# EAGLE design mega_connector_shield (EAGLE 7.3.0)
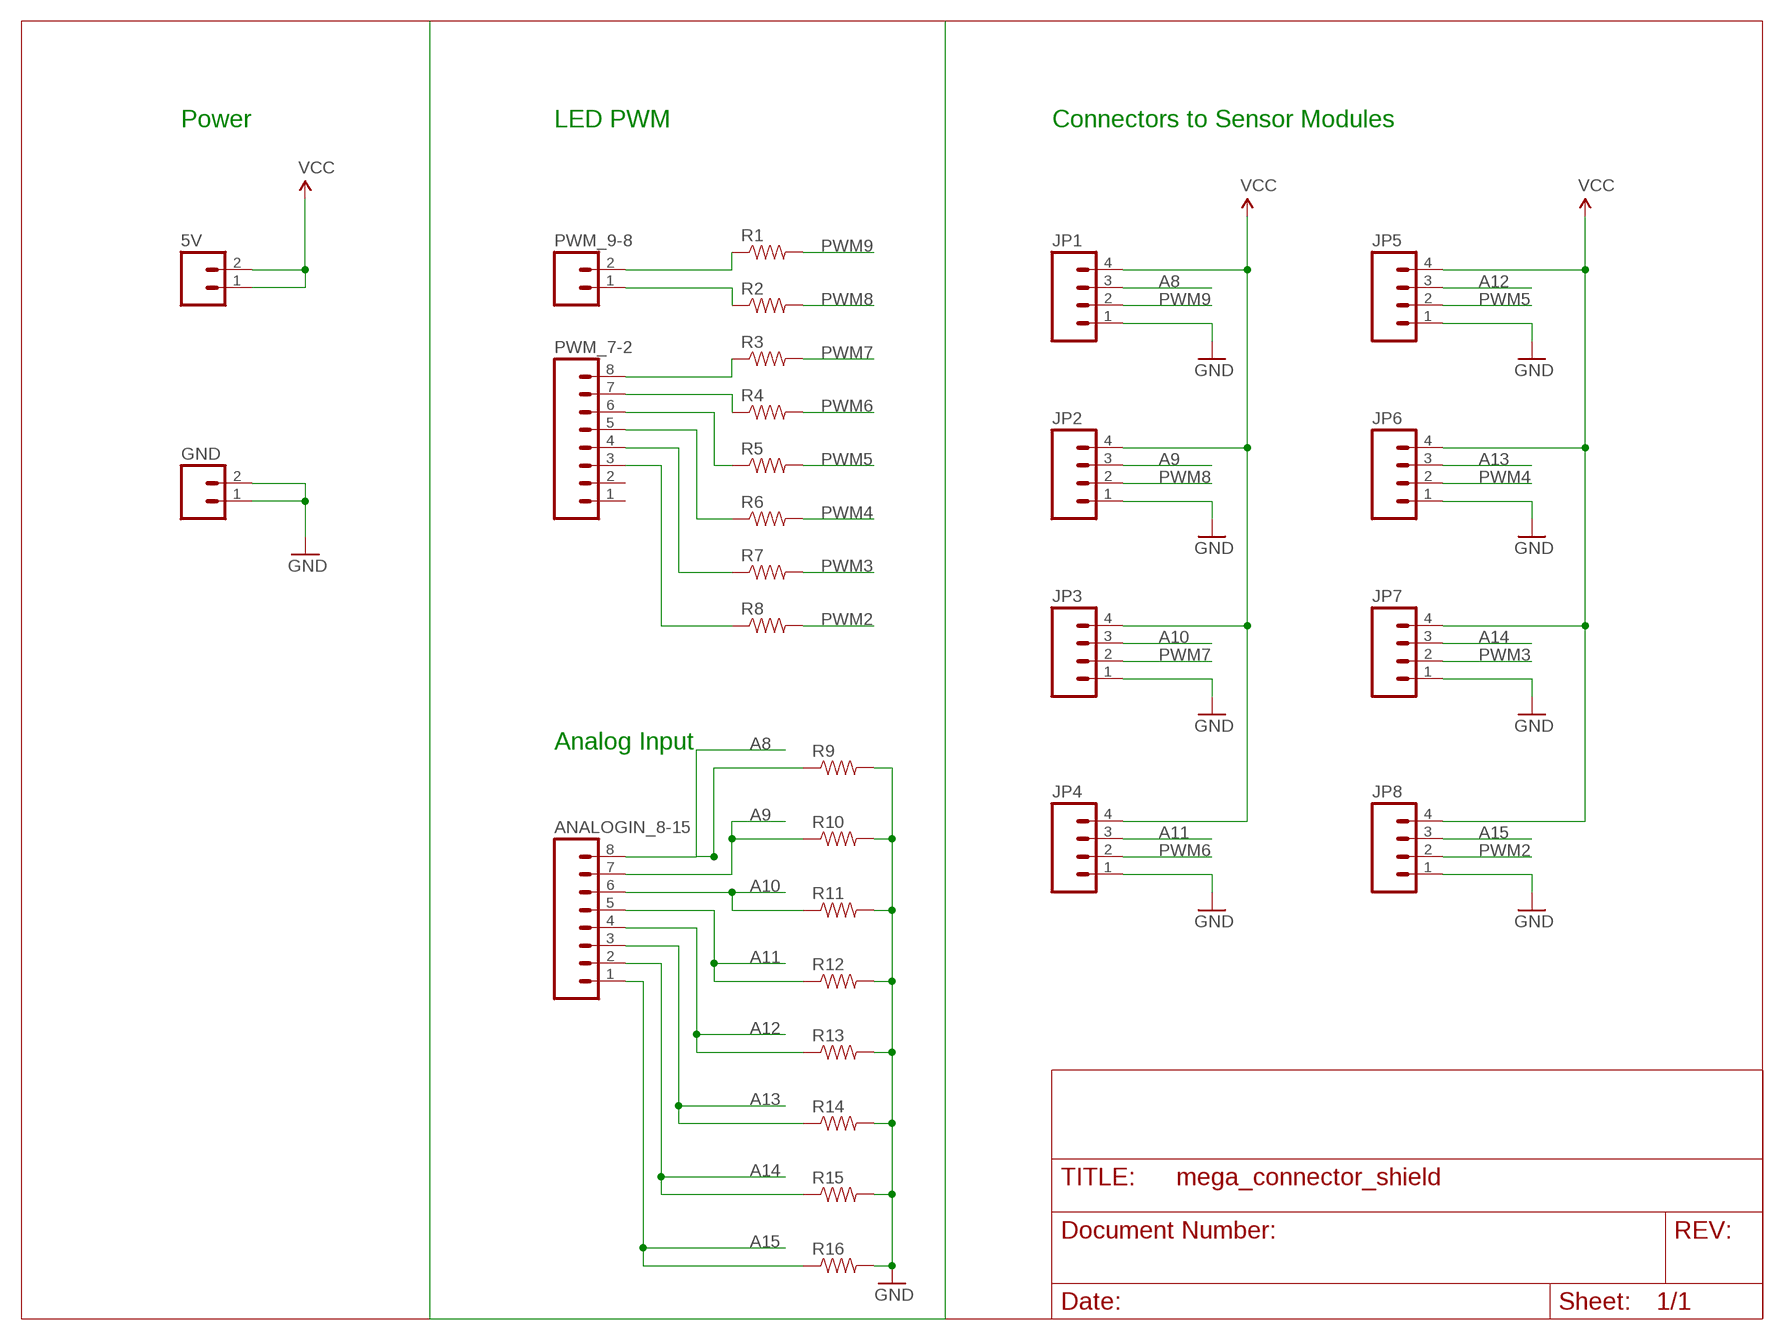
[diagram p0: schematic, sheet 1]

## Parts
5V  M02PTH  [1X02]
ANALOGIN_8-15  M08  [1X08_ROUND]
GND  M02PTH  [1X02]
JP1  M04POLAR  [MOLEX-1X4]
JP2  M04POLAR  [MOLEX-1X4]
JP3  M04POLAR  [MOLEX-1X4]
JP4  M04POLAR  [MOLEX-1X4]
JP5  M04POLAR  [MOLEX-1X4]
JP6  M04POLAR  [MOLEX-1X4]
JP7  M04POLAR  [MOLEX-1X4]
JP8  M04POLAR  [MOLEX-1X4]
PWM_7-2  M08  [1X08_ROUND]
PWM_9-8  M02PTH  [1X02]
R1  RESISTOR1206  [1206]
R2  RESISTOR1206  [1206]
R3  RESISTOR1206  [1206]
R4  RESISTOR1206  [1206]
R5  RESISTOR1206  [1206]
R6  RESISTOR1206  [1206]
R7  RESISTOR1206  [1206]
R8  RESISTOR1206  [1206]
R9  RESISTOR1206  [1206]
R10  RESISTOR1206  [1206]
R11  RESISTOR1206  [1206]
R12  RESISTOR1206  [1206]
R13  RESISTOR1206  [1206]
R14  RESISTOR1206  [1206]
R15  RESISTOR1206  [1206]
R16  RESISTOR1206  [1206]

## Nets
A8: ANALOGIN_8-15.8 JP1.3 R9.1
A9: ANALOGIN_8-15.7 JP2.3 R10.1
A10: ANALOGIN_8-15.6 JP3.3 R11.1
A11: ANALOGIN_8-15.5 JP4.3 R12.1
A12: ANALOGIN_8-15.4 JP5.3 R13.1
A13: ANALOGIN_8-15.3 JP6.3 R14.1
A14: ANALOGIN_8-15.2 JP7.3 R15.1
A15: ANALOGIN_8-15.1 JP8.3 R16.1
GND: GND.1 GND.2 JP1.1 JP2.1 JP3.1 JP4.1 JP5.1 JP6.1 JP7.1 JP8.1 R9.2 R10.2 R11.2 R12.2 R13.2 R14.2 R15.2 R16.2
N$1: PWM_9-8.2 R1.1
N$2: PWM_9-8.1 R2.1
N$3: PWM_7-2.8 R3.1
N$5: PWM_7-2.7 R4.1
N$7: PWM_7-2.6 R5.1
N$9: PWM_7-2.5 R6.1
N$11: PWM_7-2.4 R7.1
N$12: PWM_7-2.3 R8.1
PWM2: JP8.2 R8.2
PWM3: JP7.2 R7.2
PWM4: JP6.2 R6.2
PWM5: JP5.2 R5.2
PWM6: JP4.2 R4.2
PWM7: JP3.2 R3.2
PWM8: JP2.2 R2.2
PWM9: JP1.2 R1.2
VCC: 5V.1 5V.2 JP1.4 JP2.4 JP3.4 JP4.4 JP5.4 JP6.4 JP7.4 JP8.4
Unconnected: PWM_7-2.1 PWM_7-2.2

## Notes on the sheet
- Power | LED PWM | Connectors to Sensor Modules
- Analog Input

## Library data of the parts
5V GND PWM_9-8 = SparkFun-Connectors:M02: Standard 2-pin 0.1" header. Use with - straight break away headers ( PRT-00116) - right angle break away headers (PRT-00553) - swiss pins (PRT-00743) - machine pins (PRT-00117) - female headers (PRT-00115) Molex polarized connector foot print use with: PRT-08233 with associated crimp pins and housings. 2.54_SCREWTERM for use with PRT-10571. 3.5mm Screw Terminal footprints for PRT-08084 5mm Screw Terminal footprints for use with PRT-08432
ANALOGIN_8-15 PWM_7-2 = SparkFun-Connectors:M08: Header 8 Standard 8-pin 0.1" header. Use with straight break away headers (SKU : PRT-00116), right angle break away headers (PRT-00553), swiss pins (PRT-00743), machine pins (PRT-00117), and female headers (PRT-00115).
JP1-JP8 = SparkFun-Connectors:M04: Header 4 Standard 4-pin 0.1" header. Use with straight break away headers (SKU : PRT-00116), right angle break away headers (PRT-00553), swiss pins (PRT-00743), machine pins (PRT-00117), and female headers (PRT-00115). Molex polarized connector foot print use with SKU : PRT-08231 with associated crimp pins and housings. 1MM SMD Version SKU: PRT-10208
R1-R16 = SparkFun-Passives:RESISTOR: Resistor Basic schematic elements and footprints for 0603, 1206, and PTH resistors.

## Board
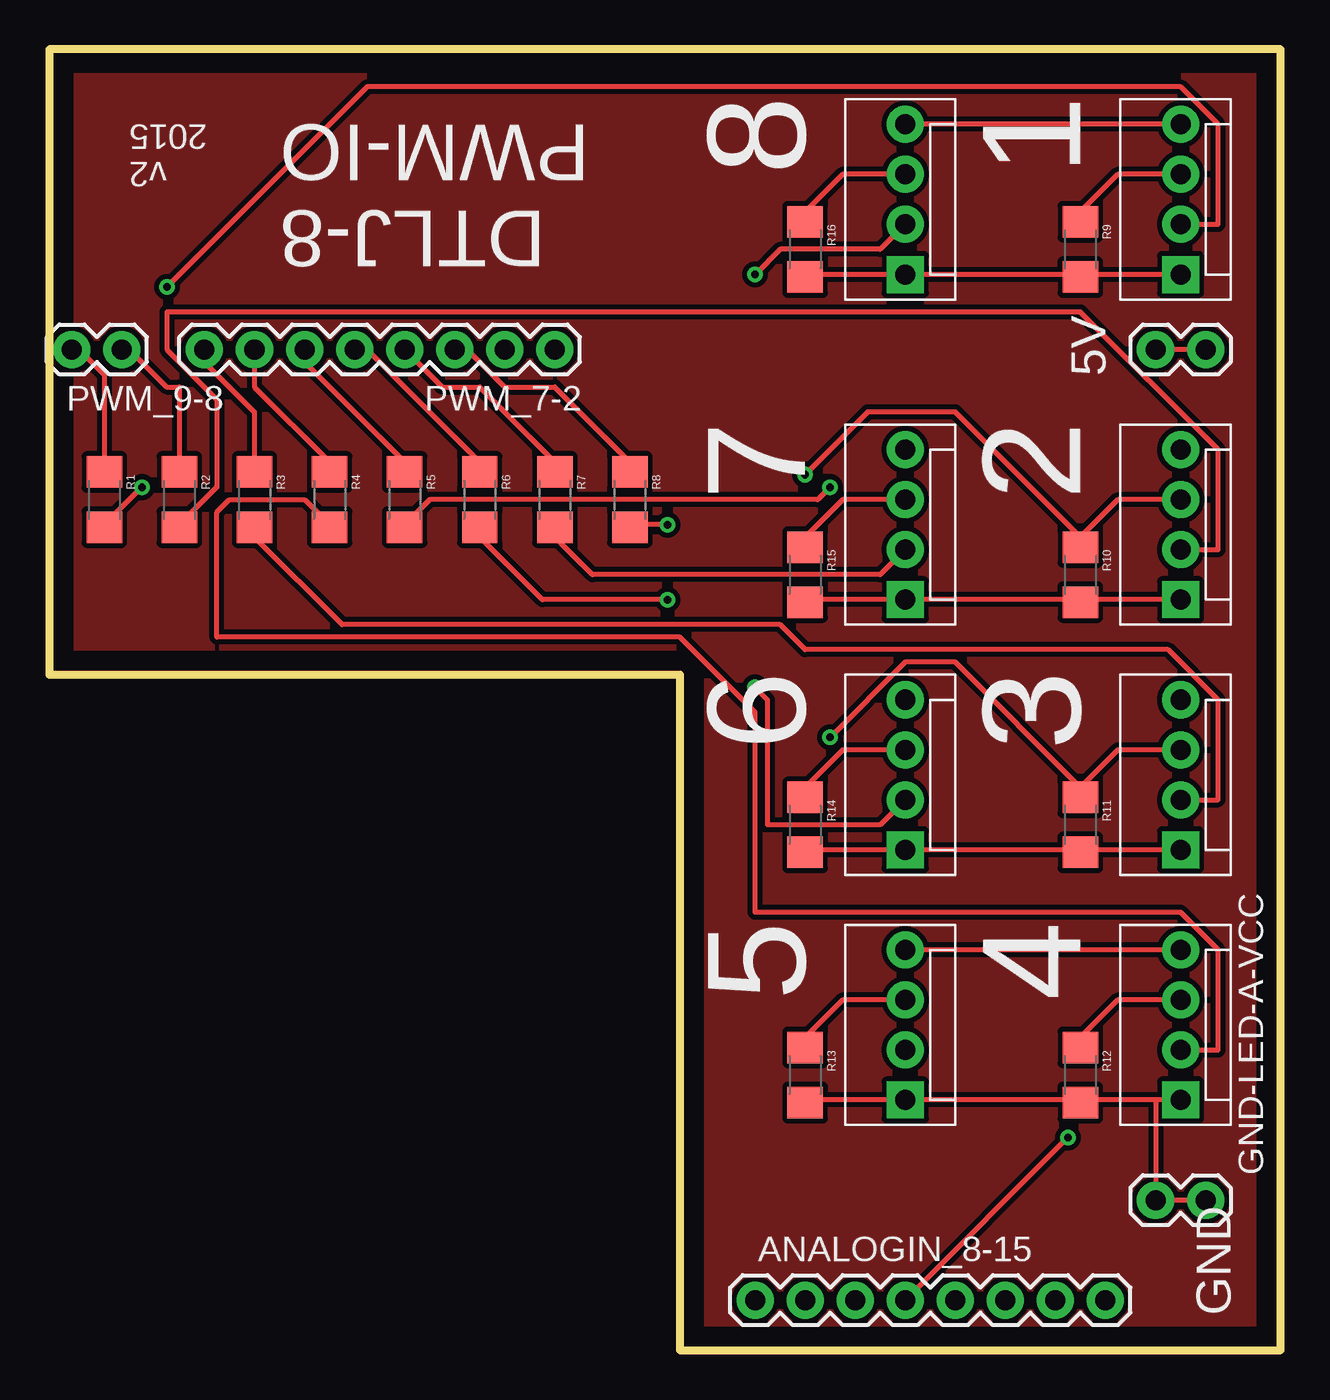
[diagram p1: board, top side]
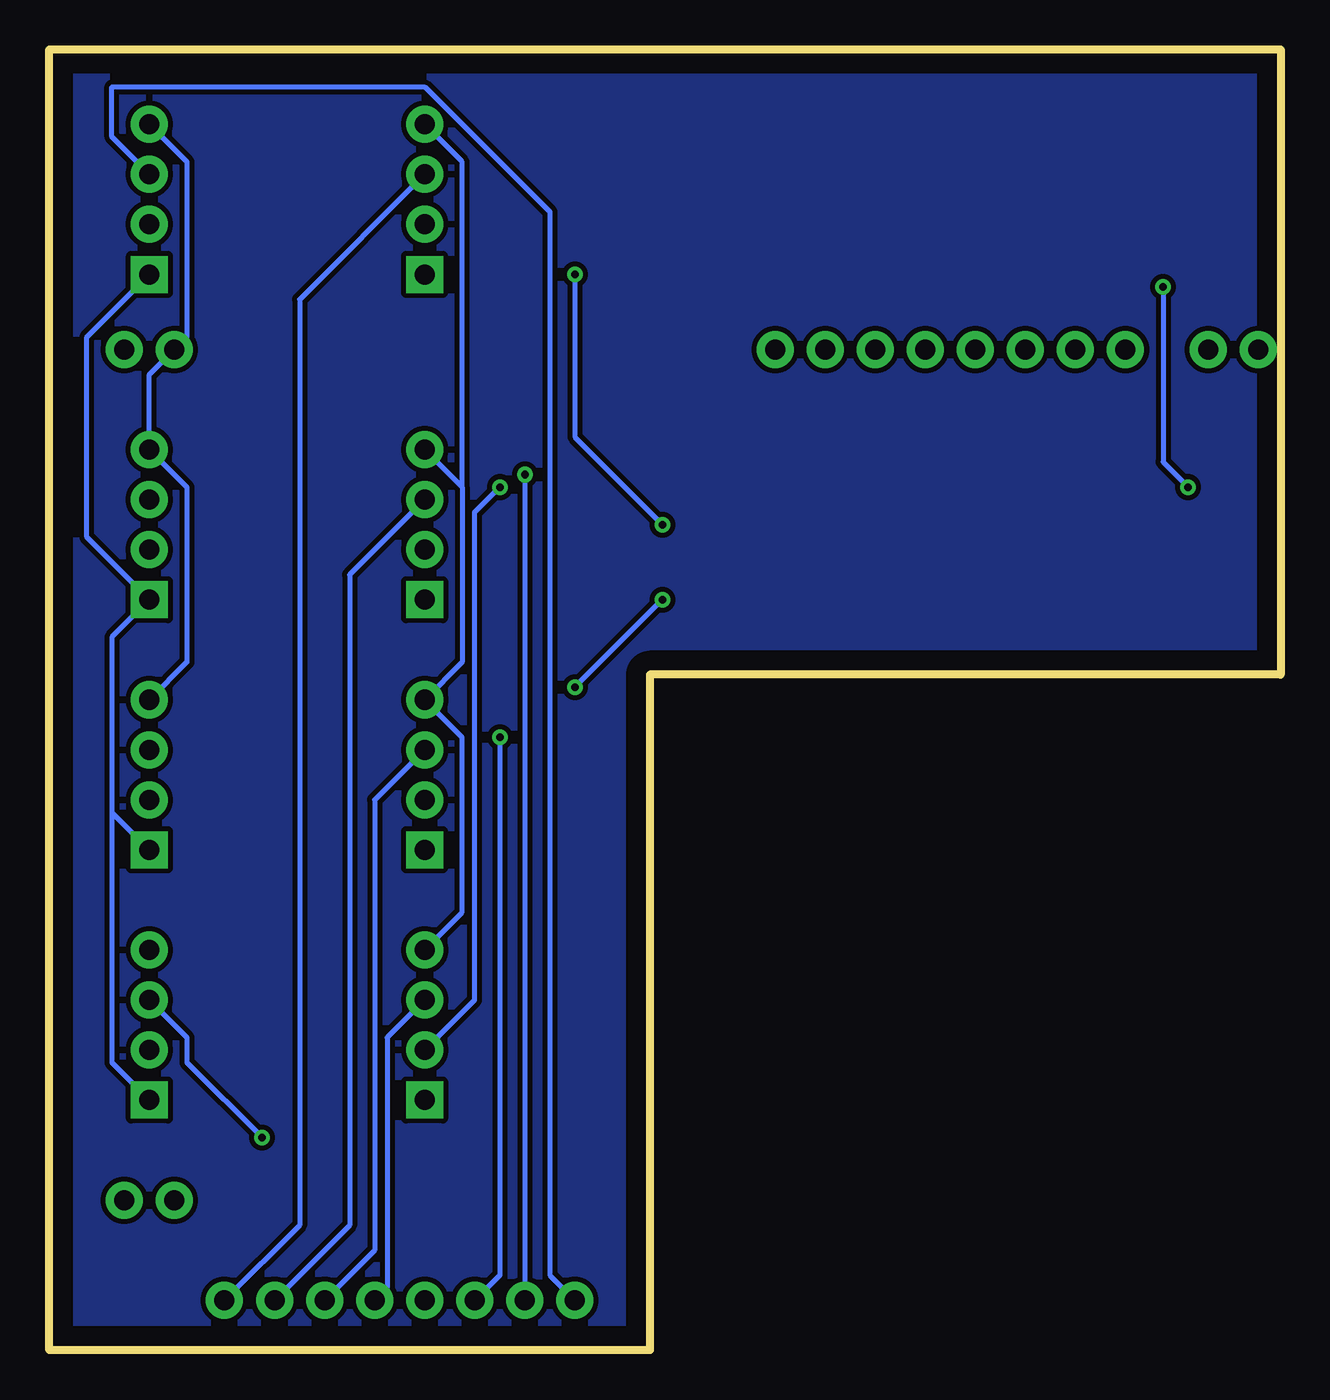
[diagram p2: board, bottom side, seen from below]

Size 62.48 x 66.04 mm. Coordinates in mm from the lower left corner, seen from the top.
Outline: 0,66.04 0,34.29 32,34.29 32,0 62.48,0 62.48,66.04 0,66.04
Copper layers (1*16): Top 0.035mm / dielectric 1.5mm / Bottom 0.035mm
Design rules "goldphoenix": minimum track width 10mil, minimum drill 15mil, track to track 10mil, track to pad 10mil, pad to pad 10mil, via to via 10mil, smd to smd 10mil, copper to edge 40mil, drill to drill 10mil, minimum pad ring 10mil, minimum via ring 8mil, stop-mask expansion 4mil, vias tented up to drill 0mil, thermal gap 10mil

### Footprints (pad centres in the part's own frame; a part is rotated, then mirrored left to right if it is on the bottom)
1X02 = drill 1.016 pad 1.88: 1 0,0; 2 2.54,0
1X08_ROUND = drill 1.016 pad 1.88: 1 0,0; 2 2.54,0; 3 5.08,0; 4 7.62,0; 5 10.16,0; 6 12.7,0; 7 15.24,0; 8 17.78,0
MOLEX-1X4 = drill 1.016 pad 1.88 square: 1 0,0 | drill 1.016 pad 1.88: 2 2.54,0; 3 5.08,0; 4 7.62,0
1206 = smd 1.6 x 1.8: 1 -1.4,0; 2 1.4,0

### Placement (x,y rotation side)
5V  56.13,50.8 0 top
ANALOGIN_8-15  53.59,2.54 180 top
GND  56.13,7.62 0 top
JP1  57.4,54.61 90 top
JP2  57.4,38.1 90 top
JP3  57.4,25.4 90 top
JP4  57.4,12.7 90 top
JP5  43.43,12.7 90 top
JP6  43.43,25.4 90 top
JP7  43.43,38.1 90 top
JP8  43.43,54.61 90 top
PWM_7-2  25.65,50.8 180 top
PWM_9-8  3.68,50.8 180 top
R1  2.79,43.18 270 top
R2  6.6,43.18 270 top
R3  10.41,43.18 270 top
R4  14.22,43.18 270 top
R5  18.03,43.18 270 top
R6  21.84,43.18 270 top
R7  25.65,43.18 270 top
R8  29.46,43.18 270 top
R9  52.32,55.88 270 top
R10  52.32,39.37 270 top
R11  52.32,26.67 270 top
R12  52.32,13.97 270 top
R13  38.35,13.97 270 top
R14  38.35,26.67 270 top
R15  38.35,39.37 270 top
R16  38.35,55.88 270 top

### Tracks (layer width: path | path; a pad name or v marks a point on that pad's centre or on a via)
A8
  Top 0.254: JP1.3 54.23,59.69 52.32,57.78 R9.1
  Bottom 0.254: ANALOGIN_8-15.8 37.08,3.81 37.08,57.78 43.43,64.14 59.31,64.14 59.31,61.59 JP1.3
A9  (via drill 0.38)
  Top 0.254: 52.32,41.27 54.23,43.18 JP2.3 | v38.35,44.45 41.53,47.62 45.97,47.62 52.32,41.27 | 52.32,41.27 R10.1
  Bottom 0.254: v38.35,44.45 ANALOGIN_8-15.7
A10  (via drill 0.38)
  Top 0.254: 52.32,28.57 54.23,30.48 JP3.3 | v39.62,31.11 43.43,34.92 45.97,34.92 52.32,28.57 | 52.32,28.57 R11.1
  Bottom 0.254: ANALOGIN_8-15.6 39.62,3.81 v39.62,31.11
A11  (via drill 0.38)
  Top 0.254: JP4.3 54.23,17.78 52.32,15.88 R12.1 | v51.69,10.79 ANALOGIN_8-15.5
  Bottom 0.254: v51.69,10.79 55.5,14.61 55.5,15.88 JP4.3
A12
  Top 0.254: JP5.3 40.26,17.78 38.35,15.88 R13.1
  Bottom 0.254: ANALOGIN_8-15.4 45.34,3.17 45.34,15.88 JP5.3
A13
  Top 0.254: JP6.3 40.26,30.48 38.35,28.57 R14.1
  Bottom 0.254: ANALOGIN_8-15.3 45.97,5.08 45.97,27.94 JP6.3
A14
  Top 0.254: JP7.3 40.26,43.18 38.35,41.27 R15.1
  Bottom 0.254: ANALOGIN_8-15.2 47.24,6.35 47.24,39.37 JP7.3
A15
  Top 0.254: JP8.3 40.26,59.69 38.35,57.78 R16.1
  Bottom 0.254: ANALOGIN_8-15.1 49.78,6.35 49.78,53.34 JP8.3
GND
  Top 0.254: R13.2 38.35,12.7 JP5.1 52.32,12.7 | GND.2 GND.1 56.13,12.7 | JP4.1 56.13,12.7 | 56.13,12.7 52.32,12.7 | 52.32,12.7 R12.2 | R16.2 38.35,54.61 JP8.1 52.32,54.61 | JP1.1 52.32,54.61 | 52.32,54.61 R9.2 | R14.2 38.35,25.4 JP6.1 52.32,25.4 | JP3.1 52.32,25.4 | 52.32,25.4 R11.2 | R15.2 38.35,38.1 JP7.1 52.32,38.1 | JP2.1 52.32,38.1 | 52.32,38.1 R10.2
  Bottom 0.254: 59.31,27.3 JP3.1 | 59.31,27.3 59.31,36.2 JP2.1 60.58,41.27 60.58,51.44 JP1.1 | JP4.1 59.31,14.61 59.31,27.3
N$1
  Top 0.254: R1.1 2.79,49.53 1.52,50.8 PWM_9-8.2
N$2
  Top 0.254: R2.1 6.6,48.9 5.97,48.9 4.06,50.8 PWM_9-8.1
N$3
  Top 0.254: R3.1 10.41,47.62 7.87,50.16 PWM_7-2.8
N$4
  pour Bottom: 0.25,66.04 62.48,66.04 62.48,0 32,0 32,34.29 0.25,34.29
N$5
  Top 0.254: PWM_7-2.7 10.41,48.9 14.22,45.09 R4.1
N$6
  pour Top: 0.25,66.04 62.48,66.04 62.48,0 32,0 32,34.29 0.25,34.29
N$7
  Top 0.254: PWM_7-2.6 12.95,50.16 18.03,45.09 R5.1
N$9
  Top 0.254: PWM_7-2.5 16.13,50.8 21.84,45.09 R6.1
N$11
  Top 0.254: PWM_7-2.4 19.94,48.9 21.84,48.9 25.65,45.09 R7.1
N$12
  Top 0.254: PWM_7-2.3 21.21,50.8 23.11,48.9 25.65,48.9 29.46,45.09 R8.1
PWM2  (via drill 0.38)
  Top 0.254: v31.37,41.91 29.46,41.91 R8.2 | v35.81,54.61 37.08,55.88 42.16,55.88 JP8.2
  Bottom 0.254: v31.37,41.91 35.81,46.35 v35.81,54.61
PWM3
  Top 0.254: JP7.2 42.16,39.37 27.56,39.37 25.65,41.27 R7.2
PWM4  (via drill 0.38)
  Top 0.254: v31.37,38.1 25.02,38.1 21.84,41.27 R6.2 | v35.81,33.66 36.45,33.02 36.45,26.67 42.16,26.67 JP6.2
  Bottom 0.254: v35.81,33.66 v31.37,38.1
PWM5  (via drill 0.38)
  Top 0.254: v39.62,43.81 38.99,43.18 19.3,43.18 18.03,41.91 R5.2
  Bottom 0.254: v39.62,43.81 40.89,42.55 40.89,17.78 JP5.2
PWM6
  Top 0.254: JP4.2 59.31,15.24 59.31,20.32 57.4,22.23 35.81,22.23 35.81,32.38 32,36.2 8.51,36.2 8.51,42.55 9.14,43.18 12.95,43.18 14.22,41.91 R4.2
PWM7
  Top 0.254: JP3.2 59.31,27.94 59.31,33.02 56.77,35.56 38.35,35.56 37.08,36.83 14.86,36.83 10.41,41.27 R3.2
PWM8
  Top 0.254: JP2.2 59.31,40.64 59.31,45.72 52.32,52.7 5.97,52.7 5.97,50.8 8.51,48.26 8.51,43.81 6.6,41.91 R2.2
PWM9  (via drill 0.38)
  Top 0.254: v4.7,43.81 2.79,41.91 R1.2 | v5.97,53.98 16.13,64.14 57.4,64.14 59.31,62.23 59.31,57.15 JP1.2
  Bottom 0.254: v4.7,43.81 5.97,45.09 v5.97,53.98
VCC
  Top 0.254: 5V.2 5V.1 | JP1.4 JP8.4 | JP4.4 JP5.4
  Bottom 0.254: JP3.4 55.5,34.92 55.5,43.81 JP2.4 57.4,49.53 5V.1 55.5,51.44 55.5,60.33 JP1.4 | 41.53,43.81 41.53,34.92 JP6.4 41.53,31.11 41.53,22.23 JP5.4 | JP7.4 41.53,43.81 | JP8.4 41.53,60.33 41.53,43.81

### Text on the board
tNames: v2 / 2015 | DTLJ-8 / PWM-IO | 8 | 1 | 7 | 2 | 6 | 3 | 5 | 4 | GND-LED-A-VCC